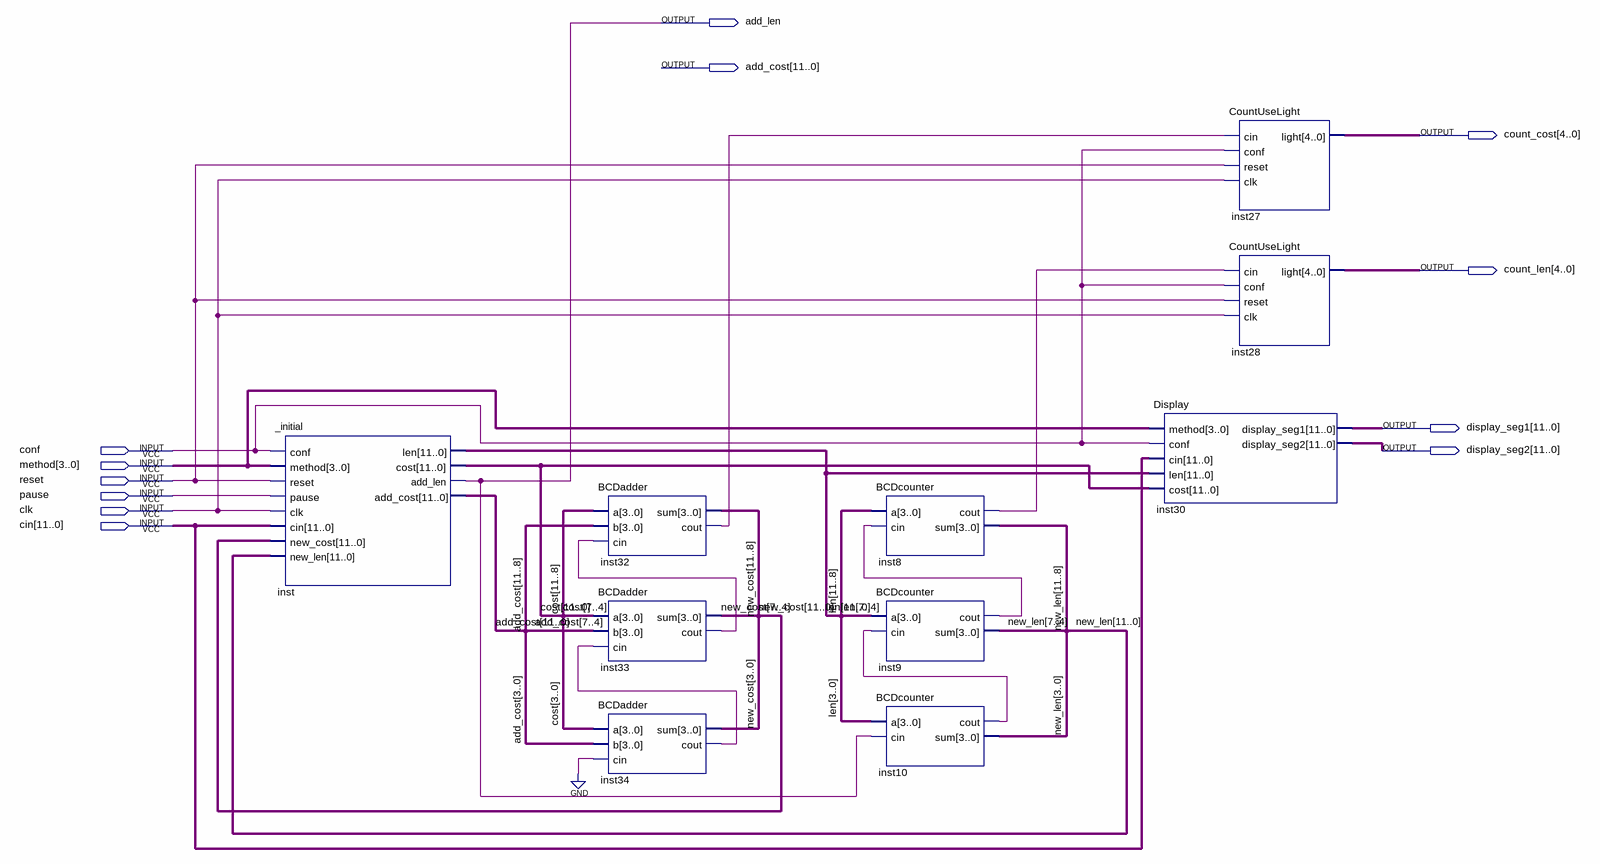
[diagram p0: schematic sheet]
// Quartus schematic shanming.bdf as structural Verilog: 10 symbols, 12 pins
module shanming (
  input  conf,
  input  [3:0] method,
  input  reset,
  input  pause,
  input  clk,
  input  [11:0] cin,
  output add_len,
  output [11:0] add_cost,
  output [4:0] count_cost,
  output [4:0] count_len,
  output [11:0] display_seg1,
  output [11:0] display_seg2
);

  wire inst8_cout, inst9_cout, inst10_cout, inst32_cout, inst33_cout, inst34_cout;
  wire [11:0] cost, len, new_cost, new_len;

  _initial inst (
    .conf(conf), .method(method), .reset(reset), .pause(pause), .clk(clk), .cin(cin), .new_cost(new_cost),
    .new_len(new_len), .len(len), .cost(cost), .add_len(add_len), .add_cost(add_cost));
  BCDadder inst32 (.a(cost[11:8]), .b(add_cost[11:8]), .cin(inst33_cout), .sum(new_cost[11:8]), .cout(inst32_cout));
  BCDadder inst33 (.a(cost[7:4]), .b(add_cost[7:4]), .cin(inst34_cout), .sum(new_cost[7:4]), .cout(inst33_cout));
  BCDadder inst34 (.a(cost[3:0]), .b(add_cost[3:0]), .cin(1'b0), .sum(new_cost[3:0]), .cout(inst34_cout));
  BCDcounter inst8 (.a(len[11:8]), .cin(inst9_cout), .cout(inst8_cout), .sum(new_len[11:8]));
  BCDcounter inst9 (.a(len[7:4]), .cin(inst10_cout), .cout(inst9_cout), .sum(new_len[7:4]));
  BCDcounter inst10 (.a(len[3:0]), .cin(add_len), .cout(inst10_cout), .sum(new_len[3:0]));
  Display inst30 (
    .method(method), .conf(conf), .cin(cin), .len(len), .cost(cost), .display_seg1(display_seg1),
    .display_seg2(display_seg2));
  CountUseLight inst27 (.cin(inst32_cout), .conf(conf), .reset(reset), .clk(clk), .light(count_cost));
  CountUseLight inst28 (.cin(inst8_cout), .conf(conf), .reset(reset), .clk(clk), .light(count_len));
endmodule
